# Altium schematic sheet Sheet_2.SchDoc
size 594 x 420 mm; SheetNumber: 2; DecimalNumber: Prototype
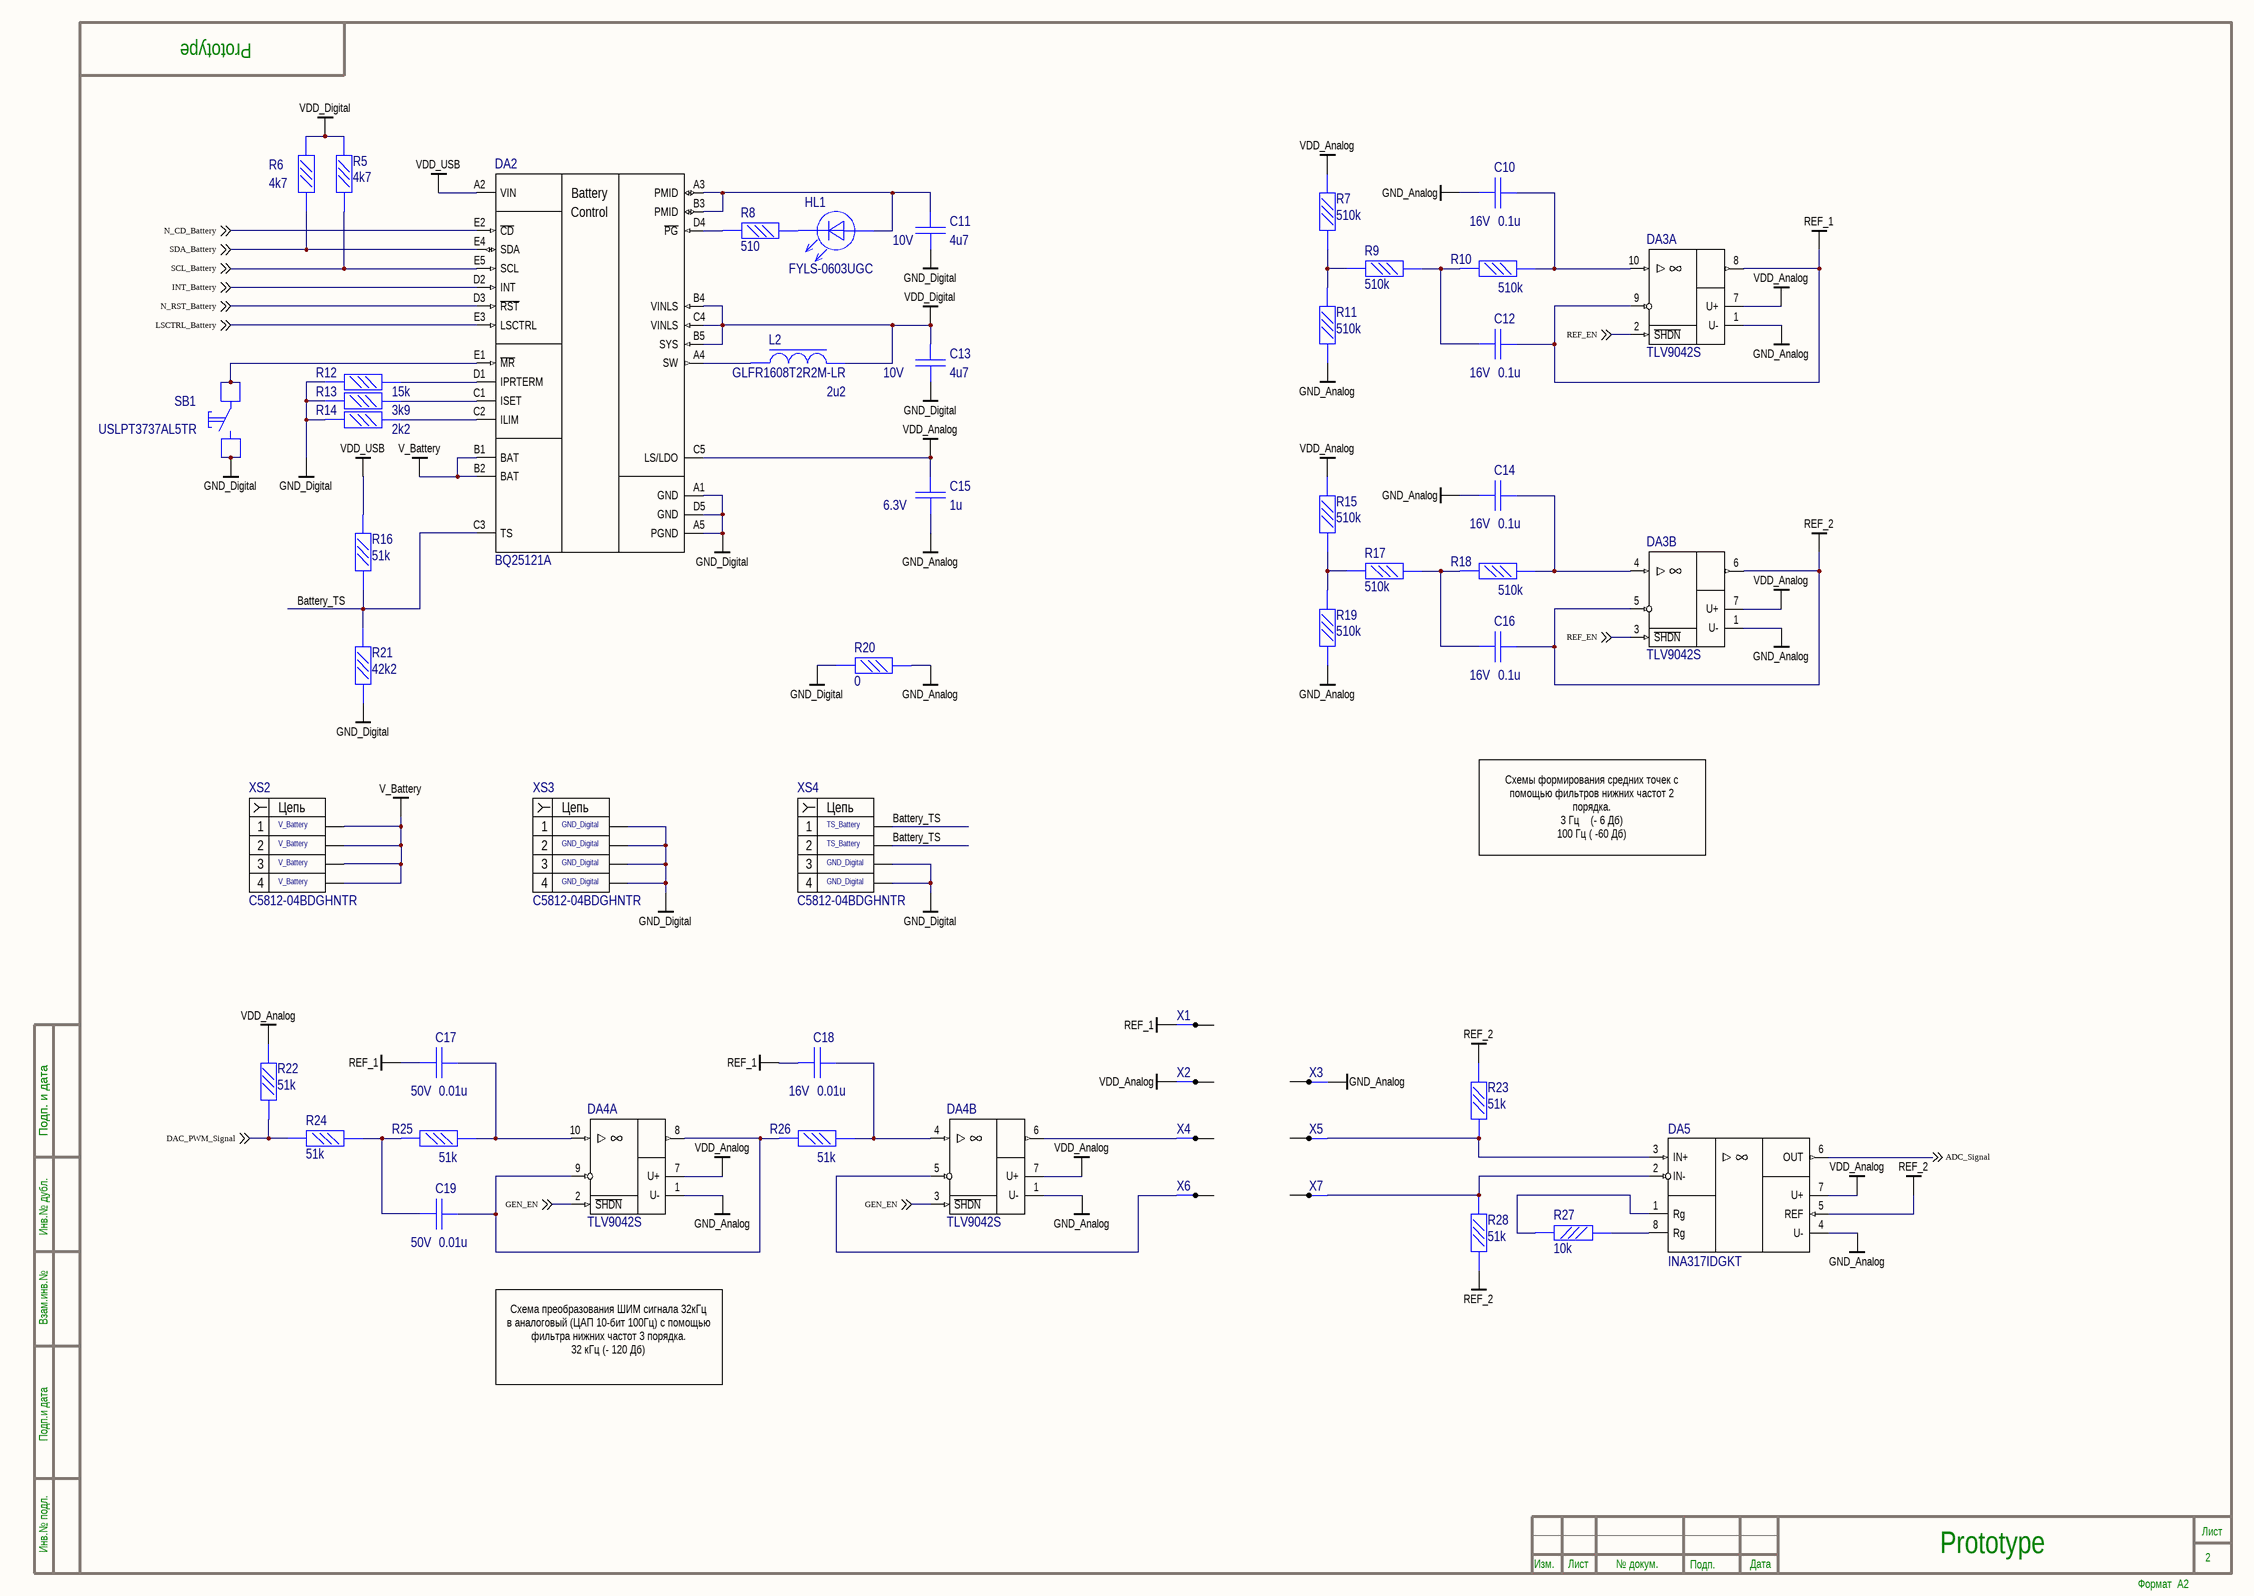
[diagram p0: Sheet_2.SchDoc]

## Parts
C10  value 0.1u  Voltage: 16V  [C0201_2]  (hidden comment: X7R)
C11  value 4u7  Voltage: 10V  [C0603]  (hidden comment: X7R)
C12  value 0.1u  Voltage: 16V  [C0201_2]  (hidden comment: X7R)
C13  value 4u7  Voltage: 10V  [C0603]  (hidden comment: X7R)
C14  value 0.1u  Voltage: 16V  [C0201_2]  (hidden comment: X7R)
C15  value 1u  Voltage: 6.3V  [C0402]  (hidden comment: X5R)
C16  value 0.1u  Voltage: 16V  [C0201_2]  (hidden comment: X7R)
C17  value 0.01u  Voltage: 50V  [C0201_2]  (hidden comment: X7R)
C18  value 0.01u  Voltage: 16V  [C0201_2]  (hidden comment: X7R)
C19  value 0.01u  Voltage: 50V  [C0201_2]  (hidden comment: X7R)
DA2  BQ25121A  [dsbga-25]
DA3  value TLV9042S  [X2QFN]  (hidden comment: TLV9042SIRUGR)  (parts A,B of 2)
DA4  value TLV9042S  [X2QFN]  (hidden comment: TLV9042SIRUGR)  (parts A,B of 2)
DA5  INA317IDGKT  [VSSOP-8]
HL1  FYLS-0603UGC  [LD0603]
L2  value 2u2  [L0603]  (hidden comment: GLFR1608T2R2M-LR)
R5  value 4k7  [R0201_2]  (hidden comment: ERJ1GN)
R6  value 4k7  [R0201_2]  (hidden comment: ERJ1GN)
R7  value 510k  [R0201_2]  (hidden comment: ERJ1GN)
R8  value 510  [R0201_2]  (hidden comment: ERJ1GN)
R9  value 510k  [R0201_2]  (hidden comment: ERJ1GN)
R10  value 510k  [R0201_2]  (hidden comment: ERJ1GN)
R11  value 510k  [R0201_2]  (hidden comment: ERJ1GN)
R12  value 15k  [R0201_2]  (hidden comment: ERJ1GN)
R13  value 3k9  [R0201_2]  (hidden comment: ERJ1GN)
R14  value 2k2  [R0201_2]  (hidden comment: ERJ1GN)
R15  value 510k  [R0201_2]  (hidden comment: ERJ1GN)
R16  value 51k  [R0201_2]  (hidden comment: ERJ1GN)
R17  value 510k  [R0201_2]  (hidden comment: ERJ1GN)
R18  value 510k  [R0201_2]  (hidden comment: ERJ1GN)
R19  value 510k  [R0201_2]  (hidden comment: ERJ1GN)
R20  value 0  [R0201_2]  (hidden comment: ERJ1GN)
R21  value 42k2  [R0201_2]  (hidden comment: ERJ1GN)
R22  value 51k  [R0201_2]  (hidden comment: ERJ1GN)
R23  value 51k  [R0201_2]  (hidden comment: ERJ1GN)
R24  value 51k  [R0201_2]  (hidden comment: ERJ1GN)
R25  value 51k  [R0201_2]  (hidden comment: ERJ1GN)
R26  value 51k  [R0201_2]  (hidden comment: ERJ1GN)
R27  value 10k  [R0201_2]  (hidden comment: ERJ1GN)
R28  value 51k  [R0201_2]  (hidden comment: ERJ1GN)
SB1  USLPT3737AL5TR  [USLPT3737AL5TR]
X1  Contact  [TEST_PIN_2]  (value not drawn)
X2  Contact  [TEST_PIN_2]  (value not drawn)
X3  Contact  [TEST_PIN_2]  (value not drawn)
X4  Contact  [TEST_PIN_2]  (value not drawn)
X5  Contact  [TEST_PIN_2]  (value not drawn)
X6  Contact  [TEST_PIN_2]  (value not drawn)
X7  Contact  [TEST_PIN_2]  (value not drawn)
XS2  1_line: V_Battery  [C5812-04]  (hidden comment: C5812-04BDGHNTR)
XS3  1_line: GND_Digital  [C5812-04]  (hidden comment: C5812-04BDGHNTR)
XS4  1_line: TS_Battery  3_line: GND_Digital  [C5812-04]  (hidden comment: C5812-04BDGHNTR)

## Nets
GND_Analog: C10.1 C14.1 C15.2 DA3.1(U-) DA4.1(U-) DA5.4(U-) R11.1 R19.1 R20.2 X3.1
GND_Digital: C11.2 C13.2 DA2.A1(GND) DA2.A5(PGND) DA2.D5(GND) R12.1 R13.1 R14.1 R20.1 R21.1 SB1.2 SB1.4 XS3.1 XS3.2 XS3.3 XS3.4 XS4.3 XS4.4
REF_1: C12.2 C17.1 C18.1 DA3.8(OUT) DA3.9(IN-) X1.1
REF_2: C16.2 DA3.5(IN-) DA3.6(OUT) DA5.5(REF) R23.2 R28.1
V_Battery: DA2.B1(BAT) DA2.B2(BAT) XS2.1 XS2.2 XS2.3 XS2.4
VDD_Analog: C15.1 DA2.C5(LS/LDO) DA3.7(U+) DA4.7(U+) DA5.7(U+) R7.2 R15.2 R22.2 X2.1
VDD_Digital: C13.1 DA2.B4(VINLS) DA2.B5(SYS) DA2.C4(VINLS) L2.2 R5.2 R6.2
VDD_USB: DA2.A2(VIN) R16.2
ADC_Signal: DA5.6(OUT) ; off-sheet ADC_Signal
Battery_TS: DA2.C3(TS) R16.1 R21.2 XS4.1 XS4.2
DAC_PWM_Signal: R22.1 R24.1 ; off-sheet DAC_PWM_Signal
GEN_EN: DA4.2(~{SHDN}) DA4.3(~{SHDN}) ; off-sheet GEN_EN
INT_Battery: DA2.D2(INT) ; off-sheet INT_Battery
LSCTRL_Battery: DA2.E3(LSCTRL) ; off-sheet LSCTRL_Battery
N_CD_Battery: DA2.E2(~{CD}) ; off-sheet N_CD_Battery
N_RST_Battery: DA2.D3(~{RST}) ; off-sheet N_RST_Battery
REF_EN: DA3.2(~{SHDN}) DA3.3(~{SHDN}) ; off-sheet REF_EN
SCL_Battery: DA2.E5(SCL) R5.1 ; off-sheet SCL_Battery
SDA_Battery: DA2.E4(SDA) R6.1 ; off-sheet SDA_Battery
NetC10_2: C10.2 DA3.10(IN+) R10.2
NetC11_1: C11.1 DA2.A3(PMID) DA2.B3(PMID) HL1.1(А)
NetC12_1: C12.1 R9.2 R10.1
NetC14_2: C14.2 DA3.4(IN+) R18.2
NetC16_1: C16.1 R17.2 R18.1
NetC17_2: C17.2 DA4.10(IN+) R25.2
NetC18_2: C18.2 DA4.4(IN+) R26.2
NetC19_1: C19.1 R24.2 R25.1
NetC19_2: C19.2 DA4.8(OUT) DA4.9(IN-) R26.1
NetDA2_A4: DA2.A4(SW) L2.1
NetDA2_C1: DA2.C1(ISET) R13.2
NetDA2_C2: DA2.C2(ILIM) R14.2
NetDA2_D1: DA2.D1(IPRTERM) R12.2
NetDA2_D4: DA2.D4(~{PG}) R8.1
NetDA2_E1: DA2.E1(~{MR}) SB1.1 SB1.3
NetDA4_5: DA4.5(IN-) X6.1
NetDA4_6: DA4.6(OUT) X4.1
NetDA5_1: DA5.1(Rg) R27.2
NetDA5_2: DA5.2(IN-) R28.2 X7.1
NetDA5_3: DA5.3(IN+) R23.1 X5.1
NetDA5_8: DA5.8(Rg) R27.1
NetHL1_2: HL1.2(К) R8.2
NetR7_1: R7.1 R9.1 R11.2
NetR15_1: R15.1 R17.1 R19.2

## Notes on the sheet
- Схемы формирования средних точек с помощью фильтров нижних частот 2 порядка.
  3 Гц    (- 6 Дб)
  100 Гц ( -60 Дб)
- Схема преобразования ШИМ сигнала 32кГц в аналоговый (ЦАП 10-бит 100Гц) с помощью фильтра нижних частот 3 порядка.
  32 кГц (- 120 Дб)
- Подп. и дата
- Инв.№ дубл.
- Взам.инв.№
- Подп.и дата
- Инв.№ подл.
- Изм.
- Лист
- № докум.
- Подп.
- Дата
- Формат  A2
- (in symbol BQ25121A) Battery; Control
- (in symbol C5812-04BDGHNTR) Цепь

## Library data of the parts
C10 C12 C14 C16-C19 = X7R C0201: Type: Конденсатор; Published: 18.05.2010; Publisher: Andrew Danich
C11 C13 = X7R C0603: Type: Конденсатор; Published: 18.05.2010; Publisher: Andrew Danich
C15 = X5R C0402: Type: Конденсатор; Published: 18.05.2010; Publisher: Andrew Danich
HL1 = FYLS-0603UGC: Type: Индикатор единичный; Published: 03.12.2013; Publisher: Andrew Danich; Value: FYLS-0603UGC
L2 = GLFR1608T2R2M-LR: Type: Дроссель; Published: 20.05.2010; Publisher: Andrew Danich; Name: GLFR1608T2R2M-LR
R5-R28 = R0201: Published: 19.09.2014; Publisher: Andrew Danich; Type: Резистор
DA2 = BQ25121A: Published: 29.07.2015; Publisher: Andrew Danich; Type: Модуль; Value: BQ25121A
DA3 DA4 = TLV9042SIRUGR: Published: 08.12.2013; Publisher: Andrew Danich; Type: Микросхема
DA5 = INA317IDGKT: Published: 19.12.2015; Publisher: Andrew Danich; Type: Микросхема; Value: INA317IDGKT
SB1 = USLPT3737AL5TR: Published: 17.04.2014; Publisher: Andrew Danich; Type: Переключатель; Value: USLPT3737AL5TR
X1-X7 = Contact: Published: 07.03.2013; Publisher: Andrew Danich; Type: Розетка
XS2-XS4 = C5812-04BDGHNTR: Published: 07.03.2013; Publisher: Andrew Danich; Type: Розетка; Value: C5812-04BDGHNTR
  XS2: 2_line: V_Battery; 3_line: V_Battery; 4_line: V_Battery
  XS3: 2_line: GND_Digital; 3_line: GND_Digital; 4_line: GND_Digital
  XS4: 2_line: TS_Battery; 4_line: GND_Digital